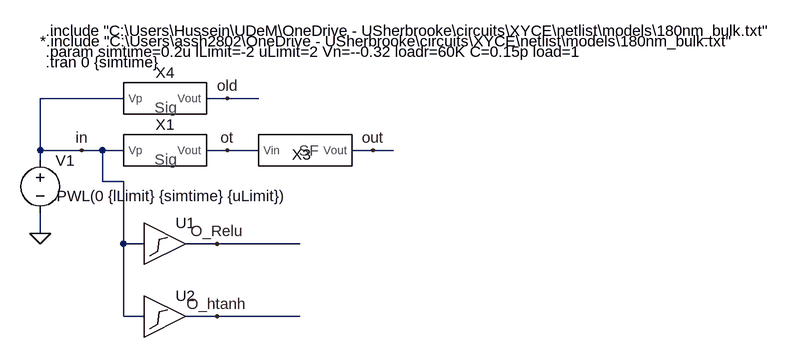
[diagram p0: schematic Test_RNN_Sigmoid3_HA.asc]
Test_RNN_Sigmoid3_HA.asc, the LTspice schematic file:
Version 4
SHEET 1 1164 680
WIRE 112 96 -16 96
WIRE 272 96 240 96
WIRE 320 96 272 96
WIRE -16 176 -16 96
WIRE 48 176 -16 176
WIRE 80 176 48 176
WIRE 112 176 80 176
WIRE 272 176 240 176
WIRE 320 176 272 176
WIRE 496 176 464 176
WIRE 528 176 496 176
WIRE -16 192 -16 176
WIRE 80 224 80 176
WIRE 112 224 80 224
WIRE -16 304 -16 272
WIRE 112 320 112 224
WIRE 144 320 112 320
WIRE 256 320 208 320
WIRE 384 320 256 320
WIRE 112 432 112 320
WIRE 144 432 112 432
WIRE 256 432 208 432
WIRE 384 432 256 432
FLAG -16 304 0
FLAG 272 176 ot
FLAG 48 176 in
FLAG 496 176 out
FLAG 272 96 old
FLAG 256 320 O_Relu
FLAG 256 432 O_htanh
SYMBOL RNN_Sigmoid3_HA 176 176 R0
SYMATTR InstName X1
SYMBOL voltage -16 176 R0
WINDOW 3 25 70 Left 0
WINDOW 123 0 0 Left 0
WINDOW 39 0 0 Left 0
SYMATTR Value PWL(0 {lLimit} {simtime} {uLimit})
SYMATTR InstName V1
SYMBOL sourceFollower 384 176 R0
SYMATTR InstName X3
SYMBOL RNN_Sigmoid3_HA 176 96 R0
SYMATTR InstName X4
SYMBOL MySym\\activ 176 256 R0
SYMATTR InstName U1
SYMATTR Value ""
SYMATTR SpiceModel ReLU
SYMBOL MySym\\activ 176 368 R0
SYMATTR InstName U2
SYMATTR Value ""
SYMATTR SpiceModel HardTanh
TEXT -8 24 Left 0 !.param simtime=0.2u lLimit=-2 uLimit=2 Vn=--0.32 loadr=60K C=0.15p load=1
TEXT -8 40 Left 0 !.tran 0 {simtime}
TEXT -16 8 Left 0 !*.include "C:\\Users\\assh2802\\OneDrive - USherbrooke\\circuits\\XYCE\\netlist\\models\\180nm_bulk.txt"
TEXT -8 -8 Left 0 !.include "C:\\Users\\Hussein\\UDeM\\OneDrive - USherbrooke\\circuits\\XYCE\\netlist\\models\\180nm_bulk.txt"

The netlist it stands for:
* Test_RNN_Sigmoid3_HA.asc
XX1 in ot RNN_Sigmoid3_HA  ; pins Vp Vout
V1 in 0 PWL(0 {lLimit} {simtime} {uLimit})
XX3 ot out sourceFollower  ; pins Vin Vout
XX4 in old RNN_Sigmoid3_HA  ; pins Vp Vout
XU1 in O_Relu ReLU  ; pins In OUT
XU2 in O_htanh HardTanh  ; pins In OUT
.param simtime=0.2u lLimit=-2 uLimit=2 Vn=--0.32 loadr=60K C=0.15p load=1
.tran 0 {simtime}
*.include "C:\Users\assh2802\OneDrive - USherbrooke\circuits\XYCE\netlist\models\180nm_bulk.txt"
.include "C:\Users\Hussein\UDeM\OneDrive - USherbrooke\circuits\XYCE\netlist\models\180nm_bulk.txt"
.backanno
.end